# EAGLE design OCTO_CONTROLER_V1 (EAGLE 6.5.0)
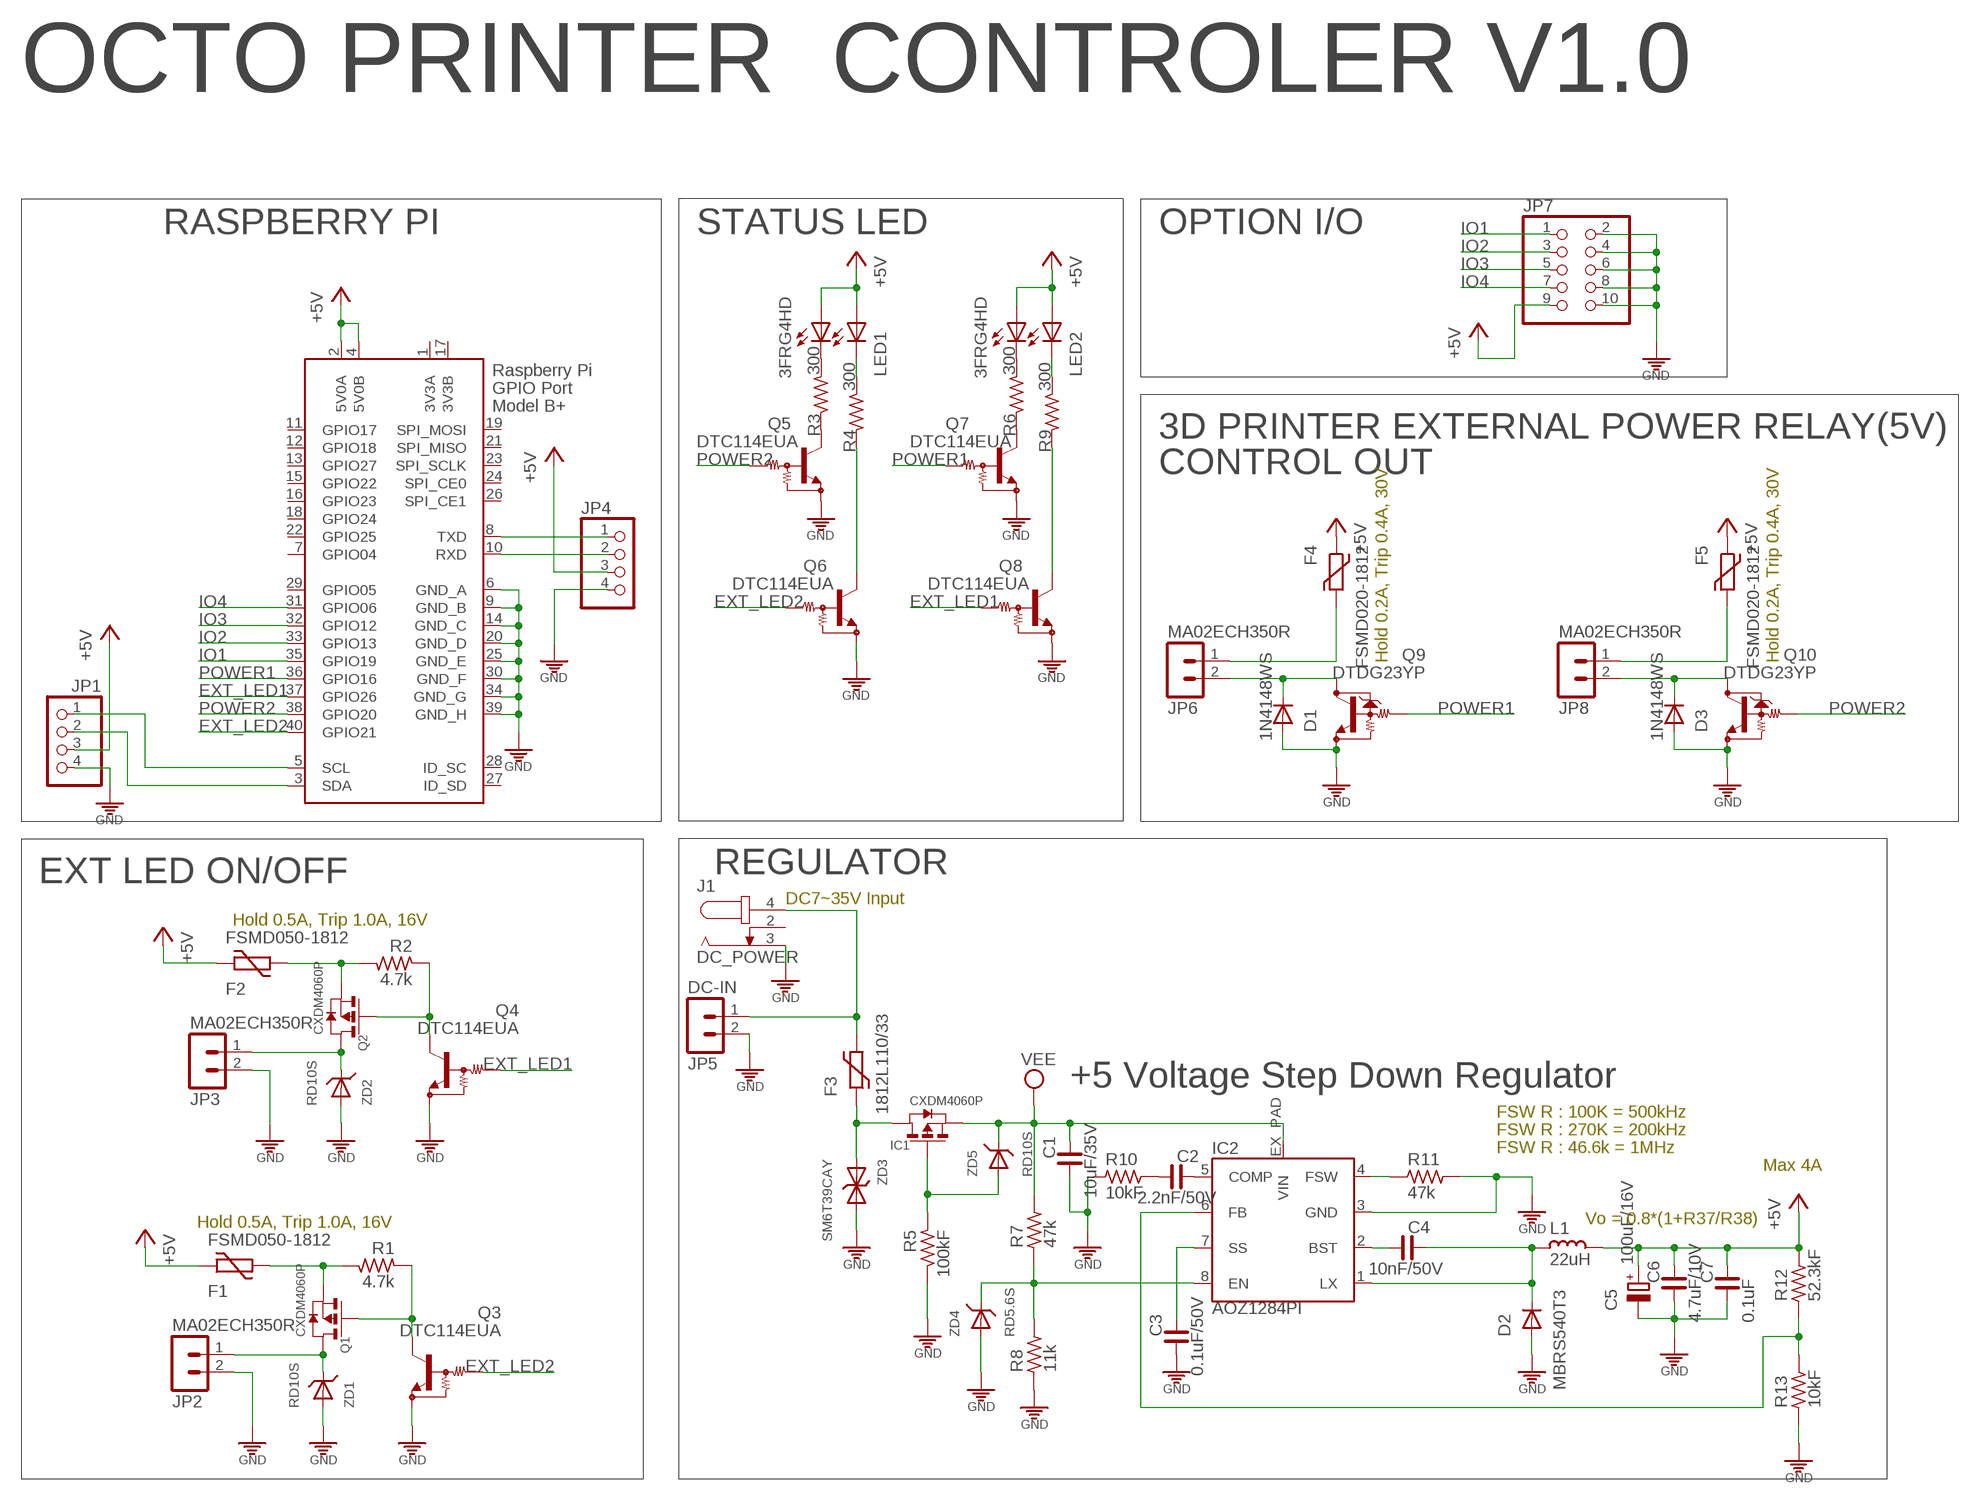
[diagram p0: schematic, sheet 1]

## Parts
C1  10uF/35V  C_3225  [C3225]
C2  2.2nF/50V  C_0603  [C0603]
C3  0.1uF/50V  C_0603  [C0603]
C4  10nF/50V  C_0603  [C0603]
C5  100uF/16V  CPOL-EUD/7343-31W  [D/7343-31W]
C6  4.7uF/10V  C_2012  [C2012]
C7  0.1uF  C_0603  [C0603]
D1  1N4148WS  B5189WN  [SOD323]
D2  MBRS540T3  DIODE-SMC  [SMC]
D3  1N4148WS  B5189WN  [SOD323]
F1  FSMD050-1812  1812L  [1812L]
F2  FSMD050-1812  1812L  [1812L]
F3  1812L110/33  1812L  [1812L]
F4  FSMD020-1812  1812L  [1812L]
F5  FSMD020-1812  1812L  [1812L]
IC1  CXDM4060P  CXDM4060PCXDM4060P  [SOT89]
IC2  AOZ1284PI  [S08-EP1]
J1  DC_POWER  DC-JACK005A  [DC-005]
JP1  PINHD-1X4  [1X04]
JP2  MA02ECH350R  [ECH350R-02]
JP3  MA02ECH350R  [ECH350R-02]
JP4  PINHD-1X4  [1X04]
JP5  DC-IN  MA02ECH350R  [ECH350R-02]
JP6  MA02ECH350R  [ECH350R-02]
JP7  PINHD-2X5/90  [2X05/90]
JP8  MA02ECH350R  [ECH350R-02]
L1  22uH  L_SHP1260P-F  [SHP1260P-F]
LED1  3FRG4HD  [3FRG4H]
LED2  3FRG4HD  [3FRG4H]
Q1  CXDM4060P  CXDM4060PCXDM4060P  [SOT89]
Q2  CXDM4060P  CXDM4060PCXDM4060P  [SOT89]
Q3  DTC114EUA  [SC59-BEC]
Q4  DTC114EUA  [SC59-BEC]
Q5  DTC114EUA  [SC59-BEC]
Q6  DTC114EUA  [SC59-BEC]
Q7  DTC114EUA  [SC59-BEC]
Q8  DTC114EUA  [SC59-BEC]
Q9  DTDG23YP  [MPT3]
Q10  DTDG23YP  [MPT3]
R1  4.7k  R_0603  [R0603]
R2  4.7k  R_0603  [R0603]
R3  300  R_0603  [R0603]
R4  300  R_0603  [R0603]
R5  100kF  R_0603  [R0603]
R6  300  R_0603  [R0603]
R7  47k  R_0603  [R0603]
R8  11k  R_0603  [R0603]
R9  300  R_0603  [R0603]
R10  10kF  R_0603  [R0603]
R11  47k  R_0603  [R0603]
R12  52.3kF  R_0603  [R0603]
R13  10kF  R_0603  [R0603]
X1  RASPI_BOARD_B+#_F  [RASPI_BOARD_B+_FULL]
ZD1  RD10S  ZENER_DIODERD47S  [DSMM]
ZD2  RD10S  ZENER_DIODERD47S  [DSMM]
ZD3  SM6T39CAY  ZDSM6T33CAY  [SMB]
ZD4  RD5.6S  ZENER_DIODERD47S  [DSMM]
ZD5  RD10S  ZENER_DIODERD47S  [DSMM]

## Nets
+5V: C5.+ C6.1 C7.1 F1.P$1 F2.P$1 F4.P$1 F5.P$1 JP1.3 JP4.3 JP7.9 L1.1 LED1.A1(A2) LED1.A(A1) LED2.A1(A2) LED2.A(A1) R12.2 X1.2(5V0A) X1.4(5V0B)
DC-IN: F3.P$1 IC1.2(D) IC1.2@1(D) ZD3.A
EXT_LED1: Q4.2(IN) Q8.2(IN) X1.37(GPIO26)
EXT_LED2: Q3.2(IN) Q6.2(IN) X1.40(GPIO21)
GND [GND]: C1.2 C3.2 C5.- C6.2 C7.2 D1.A D2.A D3.A IC2.3(GND) J1.3 JP1.4 JP2.2 JP3.2 JP4.4 JP5.2 JP7.2 JP7.4 JP7.6 JP7.8 JP7.10 Q3.1(GND) Q4.1(GND) Q5.1(GND) Q6.1(GND) Q7.1(GND) Q8.1(GND) Q9.EMITTER(GND) Q10.EMITTER(GND) R5.2 R8.1 R10.1 R11.2 R13.1 X1.6(GND_A) X1.9(GND_B) X1.14(GND_C) X1.20(GND_D) X1.25(GND_E) X1.30(GND_F) X1.34(GND_G) X1.39(GND_H) ZD1.A ZD2.A ZD3.C(K) ZD4.A
IO1: JP7.1 X1.35(GPIO19)
IO2: JP7.3 X1.33(GPIO13)
IO3: JP7.5 X1.32(GPIO12)
IO4: JP7.7 X1.31(GPIO06)
N$1: D1.C JP6.2 Q9.COLLECTOR(OUT)
N$2: Q1.3(G) Q3.3(OUT) R1.1
N$3: JP2.1 Q1.2(D) Q1.2@1(D) ZD1.C
N$4: F2.P$2 Q2.1(S) R2.2
N$7: F1.P$2 Q1.1(S) R1.2
N$8: D3.C JP8.2 Q10.COLLECTOR(OUT)
N$9: F5.P$2 JP8.1
N$11: F4.P$2 JP6.1
N$12: IC2.6(FB) R12.1 R13.2
N$13: JP1.1 X1.5(SCL)
N$14: C4.2 IC2.2(BST)
N$15: JP3.1 Q2.2(D) Q2.2@1(D) ZD2.C
N$16: JP1.2 X1.3(SDA)
N$17: JP4.1 X1.8(TXD)
N$18: JP4.2 X1.10(RXD)
N$27: C4.1 D2.C IC2.1(LX) L1.2
N$28: IC2.4(FSW) R11.1
N$29: C3.1 IC2.7(SS)
N$30: IC2.8(EN) R7.1 R8.2 ZD4.C
N$31: C2.1 IC2.5(COMP)
N$32: Q2.3(G) Q4.3(OUT) R2.1
N$34: C2.2 R10.2
N$60: Q5.3(OUT) R3.2
N$61: LED1.K(C1) R3.1
N$62: LED1.K1(C2) R4.1
N$77: Q7.3(OUT) R6.2
N$78: LED2.K(C1) R6.1
N$79: LED2.K1(C2) R9.1
N$80: Q8.3(OUT) R9.2
N$85: Q6.3(OUT) R4.2
N$98: IC1.3(G) R5.1 ZD5.A
N$99: F3.P$2 J1.4 JP5.1
POWER1: Q7.2(IN) Q9.BASE(IN) X1.36(GPIO16)
POWER2: Q5.2(IN) Q10.BASE(IN) X1.38(GPIO20)
VEE: C1.1 IC1.1(S) IC2.EX_PAD(VIN) R7.2 ZD5.C
Unconnected: J1.2 X1.7(GPIO04) X1.11(GPIO17) X1.12(GPIO18) X1.13(GPIO27) X1.15(GPIO22) X1.16(GPIO23) X1.18(GPIO24) X1.19(SPI_MOSI) X1.21(SPI_MISO) X1.22(GPIO25) X1.23(SPI_SCLK) X1.24(SPI_CE0) X1.26(SPI_CE1) X1.27(ID_SD) X1.28(ID_SC) X1.29(GPIO05)

## Notes on the sheet
- OCTO PRINTER  CONTROLER V1.0
- RASPBERRY PI | STATUS LED | OPTION I/O
- 3D PRINTER EXTERNAL POWER RELAY(5V)
- CONTROL OUT
- Hold 0.2A, Trip 0.4A, 30V | Hold 0.2A, Trip 0.4A, 30V
- EXT LED ON/OFF
- REGULATOR
- DC7~35V Input
- Hold 0.5A, Trip 1.0A, 16V
- +5 Voltage Step Down Regulator
- FSW R : 100K = 500kHz
- FSW R : 270K = 200kHz
- FSW R : 46.6k = 1MHz
- Max 4A
- Vo = 0.8*(1+R37/R38)
- Hold 0.5A, Trip 1.0A, 16V

## Power pins joined to a net without a drawn wire
3V3A: X1.1(3V3A)
3V3B: X1.17(3V3B)

## Library data of the parts
C1-C4 C6 C7 = cona_lib:C_: NON-POLARIZED CAP
C5 = cona_lib:CPOL-EU: POLARIZED CAPACITOR, European symbol
D1 D3 = cona_lib:B5189W
D2 = diode:DIODE-: DIODE
F1-F5 = ptc-littlefuse:1812L
IC1 Q1 Q2 = cona_lib:CXDM4060P
IC2 = cona_lib:AOZ1284PI
J1 = cona_lib:DC-JACK
JP1 JP4 = pinhead_254:PINHD-1X4: PIN HEADER
JP2 JP3 JP5 JP6 JP8 = cona_lib:MA02
JP7 = pinhead_254:PINHD-2X5: PIN HEADER
L1 = cona_lib:L_: INDUCTOR
LED1 LED2 = cona_lib:3FRG4HD
Q3-Q8 = cona_lib:DTC114EUA: NPN Bias Resistor Transistor
Q9 Q10 = cona_lib:DTDG23YP
R1-R13 = cona_lib:R_: RESISTOR
X1 = raspberrypi_bastelstube_v13:RASPI_BOARD_B+#: Raspberry Pi GPIO connector with markings for the outer dimensions of the Raspberry Pi board model B+ with different sets of drill holes or mounting pads All pins connected
ZD1 ZD2 ZD4 ZD5 = GRU-EURO6:ZENER_DIODE
ZD3 = GRU-EURO6:ZD

## Net classes
0 default: clearance 0.152 mm
1 power: width 0.152 mm
2 GND: width 0.152 mm, clearance 0.152 mm

## Board
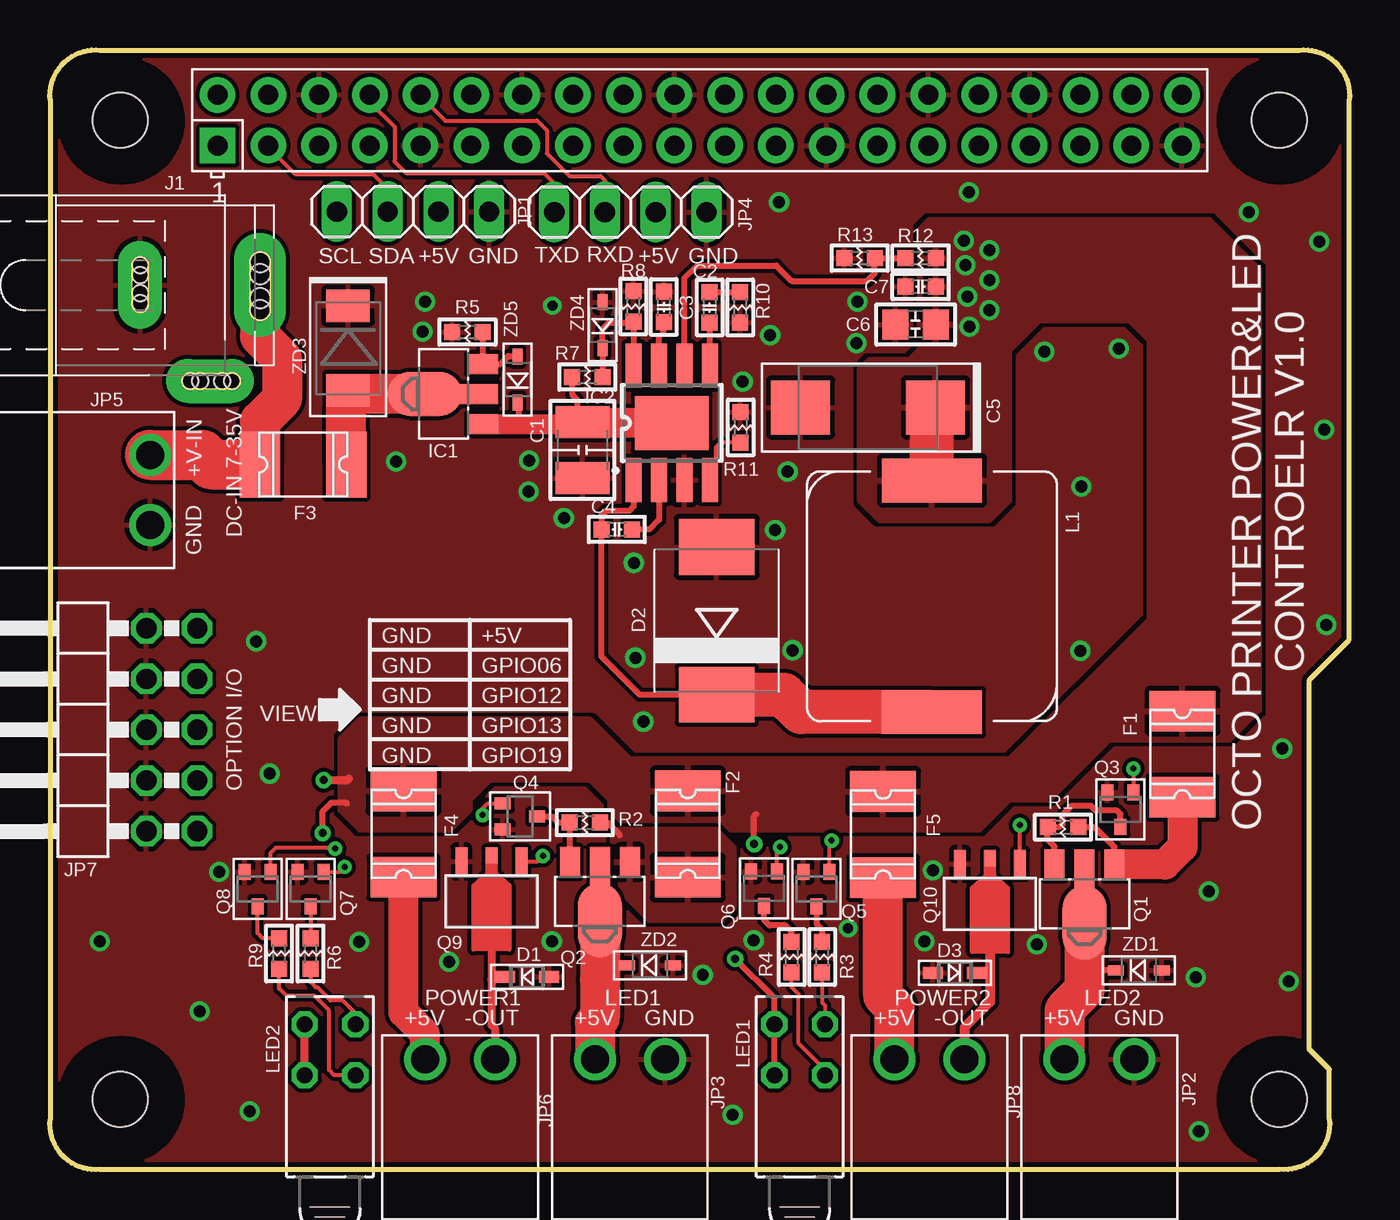
[diagram p1: board, top side]
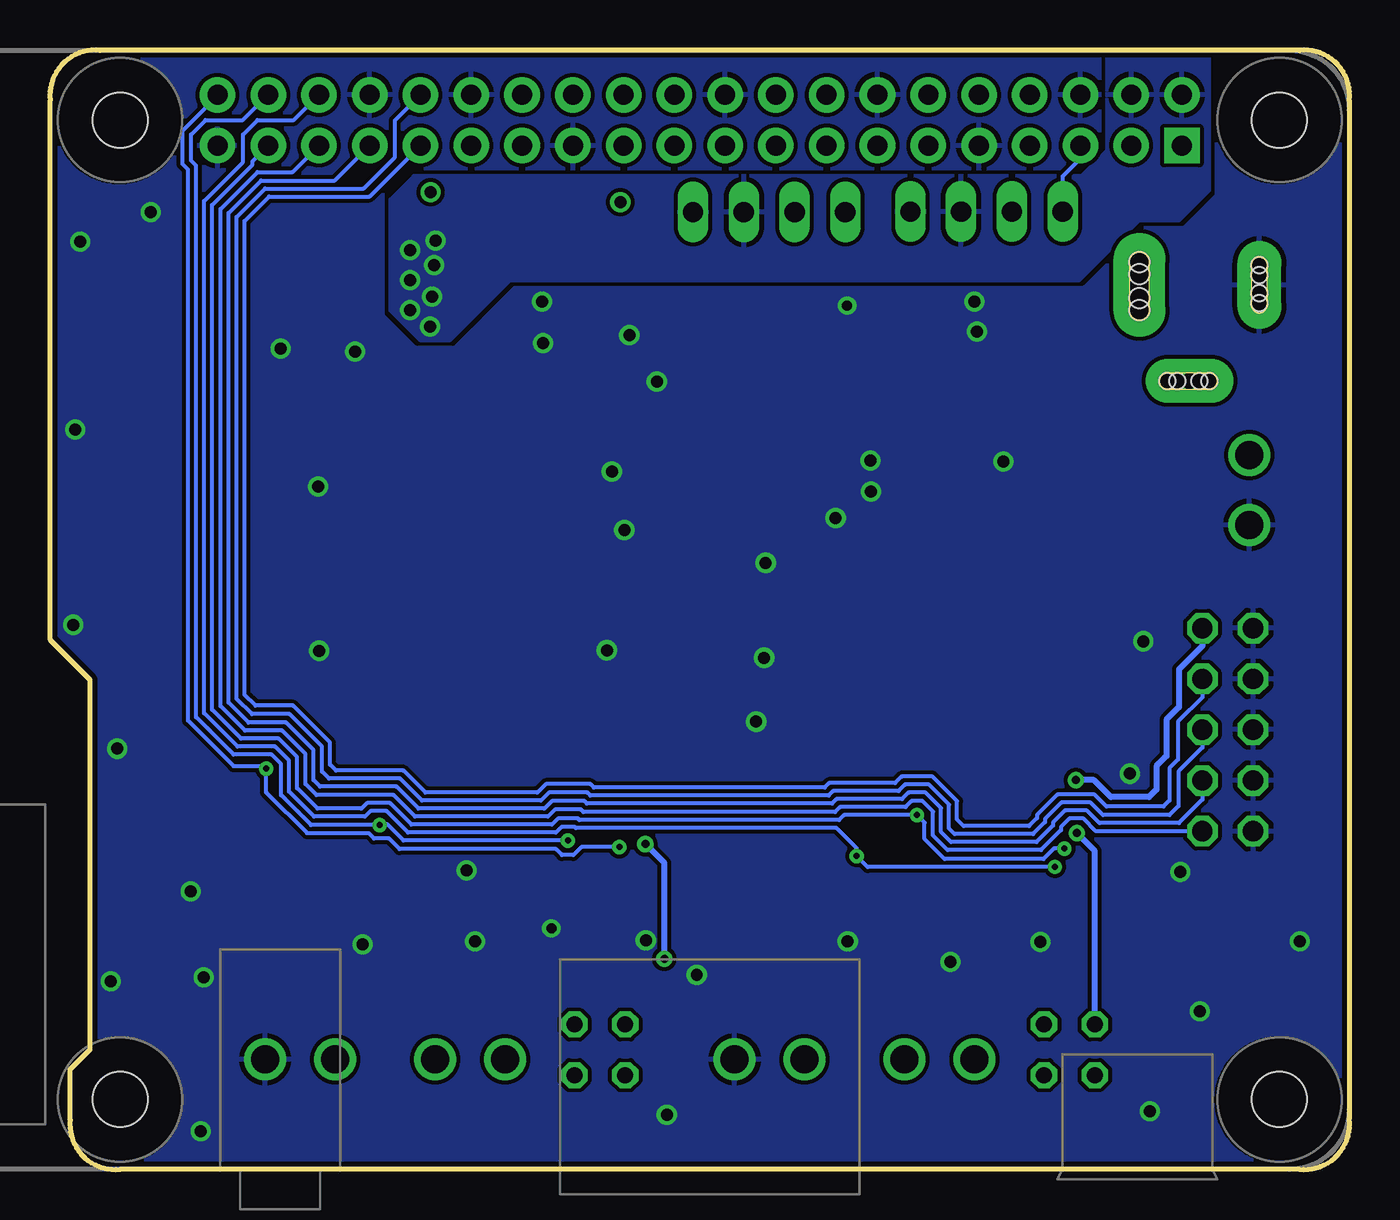
[diagram p2: board, bottom side, seen from below]

Size 65.03 x 56.03 mm. Coordinates in mm from the lower left corner, seen from the top.
Outline: 0.01,53.51 0.01,2.51 arc103 2.51,0.01 61.51,0.01 arc103 64.01,2.51 64.01,5.01 63.01,6.01 63.01,24.51 65.01,26.51 65.01,53.51 arc103 62.51,56.01 2.51,56.01 arc103 0.01,53.51
Copper layers (1*16): Top 0.035mm / dielectric 1.5mm / Bottom 0.035mm
Design rules "KHC_mm": minimum track width 0.2mm, minimum drill 0.3mm, track to track 0.2mm, track to pad 0.2mm, pad to pad 0.2mm, via to via 0.2mm, smd to smd 0.2mm, copper to edge 10mil, drill to drill 0.2mm, minimum pad ring 10mil, minimum via ring 8mil, stop-mask expansion 4mil, vias tented up to drill 0mil, thermal gap 10mil

### Footprints (pad centres in the part's own frame; a part is rotated, then mirrored left to right if it is on the bottom)
C3225 = smd 1.6 x 2.7: 1 -1.397,0; 2 1.397,0
C0603 = smd 0.8 x 0.8: 1 -0.762,0; 2 0.762,0
D/7343-31W = smd 2.95 x 2.7: + 3.375,0; - -3.375,0
C2012 = smd 1.3 x 1.5: 1 -1.016,0; 2 1.016,0
SOD323 = smd 1 x 0.6: A 1.1,0; C -1.1,0
SMC = smd 2.8 x 3.8: A 3.7,0; C -3.7,0
1812L = smd 2.03 x 3.3: P$1 -2.16,0; P$2 2.16,0
SOT89 = smd 1 x 1.5: 1 -1.499,-1.981; 3 1.499,-1.981 | smd 1 x 2: 2 0,-1.727 | smd 2.2 x 3.7: 2@1 0,0.94
S08-EP1 = smd 0.8 x 2.2: 1 -1.905,-2.87; 2 -0.635,-2.87; 3 0.635,-2.87; 4 1.905,-2.87; 5 1.905,2.87; 6 0.635,2.87; 7 -0.635,2.87; 8 -1.905,2.87 | smd 3.7 x 2.71: EX_PAD 0,0
DC-005 = drill 0.8 pad 2.2 long: 2 11,-4.8; 3 7.5,0 | drill 1 pad 2.6 long: 4 13.5,0 | hole 0.8: 7.5,1; 7.5,0.5; 7.5,-0.9; 7.5,-0.4; 10,-4.8; 10.5,-4.8; 12.1,-4.8; 11.6,-4.8 | hole 1: 13.5,1.15; 13.5,0.55; 13.5,-1.25; 13.5,-0.65
1X04 = drill 1.016 long: 1 -3.81,0; 2 -1.27,0; 3 1.27,0; 4 3.81,0
ECH350R-02 = drill 1.4: 1 -1.75,0; 2 1.75,0
2X05/90 = drill 1.016 octagon: 1 -5.08,-6.35; 2 -5.08,-3.81; 3 -2.54,-6.35; 4 -2.54,-3.81; 5 0,-6.35; 6 0,-3.81; 7 2.54,-6.35; 8 2.54,-3.81; 9 5.08,-6.35; 10 5.08,-3.81
SHP1260P-F = smd 2.2 x 5: 1 -5.8,0; 2 5.8,0
3FRG4H = drill 0.8 octagon: A 0,1.27; A1 -2.54,1.27; K 0,-1.27; K1 -2.54,-1.27
SC59-BEC = smd 0.6 x 0.8: 1 0.65,-0.863; 2 -0.65,-0.863; 3 0,0.863
MPT3 = smd 0.6 x 1.4: BASE -1.5,-2; EMITTER 1.5,-2 | smd 0.6 x 0.8: COLLECTOR 0,-2.3
R0603 = smd 0.8 x 0.8: 1 -0.762,0; 2 0.762,0
RASPI_BOARD_B+_FULL = drill 1 pad 1.778 square: 1 8.37,51.23 | drill 1 pad 1.778: 2 8.37,53.77; 3 10.91,51.23; 4 10.91,53.77; 5 13.45,51.23; 6 13.45,53.77; 7 15.99,51.23; 8 15.99,53.77; 9 18.53,51.23; 10 18.53,53.77; 11 21.07,51.23; 12 21.07,53.77; 13 23.61,51.23; 14 23.61,53.77; 15 26.15,51.23; 16 26.15,53.77; 17 28.69,51.23; 18 28.69,53.77; 19 31.23,51.23; 20 31.23,53.77; 21 33.77,51.23; 22 33.77,53.77; 23 36.31,51.23; 24 36.31,53.77; 25 38.85,51.23; 26 38.85,53.77; 27 41.39,51.23; 28 41.39,53.77; 29 43.93,51.23; 30 43.93,53.77; 31 46.47,51.23; 32 46.47,53.77; 33 49.01,51.23; 34 49.01,53.77; 35 51.55,51.23; 36 51.55,53.77; 37 54.09,51.23; 38 54.09,53.77; 39 56.63,51.23; 40 56.63,53.77 | hole 2.75: 3.5,3.5; 3.5,52.5; 61.5,3.5; 61.5,52.5
DSMM = smd 0.8 x 0.5: A 1.15,0; C -1.15,0
SMB = smd 1.62 x 2.18: A 2.11,0; C -2.11,0

### Placement (x,y rotation side)
C1  26.64,36.01 270 top
C2  33.01,43.14 90 top
C3  30.71,43.16 90 top
C4  28.36,32.04 0 top
C5  40.94,38.14 0 top
C6  43.31,42.29 180 top
C7  43.56,44.19 180 top
D1  23.86,9.64 0 top
D2  33.36,27.46 90 top
D3  45.29,9.84 180 top
F1  56.66,20.79 270 top
F2  31.91,16.79 270 top
F3  12.66,35.29 180 top
F4  17.69,16.79 270 top
F5  41.69,16.76 270 top
IC1  19.69,38.81 90 top
IC2  31.11,37.36 0 top
J1  -2.99,44.26 0 top
JP1  18.16,47.94 0 top
JP2  52.51,5.51 0 top
JP3  29.01,5.51 0 top
JP4  29.04,47.91 0 top
JP5  5.01,34.01 270 top
JP6  20.51,5.51 0 top
JP7  1.01,22.01 90 top
JP8  44.01,5.51 0 top
L1  44.14,28.69 270 top
LED1  37.51,7.26 90 top
LED2  14.01,7.26 90 top
Q1  51.76,13.29 180 top
Q2  27.51,13.41 180 top
Q3  53.56,18.01 180 top
Q4  23.51,17.66 270 top
Q5  38.36,14.04 180 top
Q6  35.74,14.06 180 top
Q7  13.04,14.04 180 top
Q8  10.39,14.04 180 top
Q9  22.09,13.41 180 top
Q10  47.04,13.29 180 top
R1  50.69,17.14 0 top
R2  26.76,17.36 0 top
R3  38.64,10.64 90 top
R4  37.11,10.64 90 top
R5  20.89,41.91 180 top
R6  13.04,10.81 90 top
R7  26.89,39.66 180 top
R8  29.19,43.19 270 top
R9  11.46,10.81 90 top
R10  34.54,43.14 90 top
R11  34.56,37.14 90 top
R12  43.56,45.61 0 top
R13  40.51,45.61 0 top
X1  0.01,0.01 0 top
ZD1  54.49,9.96 0 top
ZD2  30.01,10.21 0 top
ZD3  14.91,41.11 270 top
ZD4  27.64,42.26 90 top
ZD5  23.39,39.54 90 top

### Tracks (layer width: path | path; a pad name or v marks a point on that pad's centre or on a via)
+5V  (via drill 0.4, 0.6)
  Top 0.3: LED1.A1 LED1.A 36.24,8.58 v34.29,10.54 | v35.24,16.29 35.24,17.69 35.34,17.79 | v13.64,16.84 13.64,17.91 14.09,18.36 14.81,18.36 14.86,18.31
  Top 0.4: LED2.A1 LED2.A | v13.69,19.49 14.89,19.49 14.96,19.56
  Top 2.2: L1.1 44.14,37.96 C5.+
  Bottom 0.3: v34.29,10.54 34.29,15.34 v35.24,16.29 | LED2.A 12.74,15.94 v13.64,16.84 | JP7.9 7.36,26.21 8.54,25.04 8.54,23.14 9.16,22.51 9.16,20.69 9.66,20.19 9.66,19.01 10.04,18.64 11.94,18.64 12.79,19.49 v13.69,19.49
  other vias: 47.01,46.01 47.01,44.51 47.01,43.01 45.81,45.26 45.91,43.69 46.01,42.19 45.74,46.49
  pour Top: 41.51,32.51 47.01,32.51 48.01,33.51 48.01,46.01 47.01,47.01 44.01,47.01 43.51,46.51 43.51,41.01 43.01,40.51 41.01,40.51 40.51,40.01 40.51,33.51
  pour Bottom: 7.01,56.01 12.14,56.01 12.14,50.99 13.41,49.71 46.81,49.71 48.01,48.51 48.01,43.01 46.51,41.51 45.01,41.51 42.01,44.51 13.51,44.51 10.51,47.51 8.51,47.51 7.01,49.01
  pour Top (rank 2): 15.51,17.01 20.01,17.01 21.01,18.01 21.01,18.51 22.01,19.51 27.01,19.51 28.01,18.51 28.01,18.01 29.01,17.01 46.51,17.01 48.01,18.51 50.01,18.51 53.01,21.51 59.01,21.51 60.51,23.01 60.51,45.01 58.01,47.51 44.01,47.51 43.51,47.01 43.51,45.01 46.01,42.51 47.51,40.51 49.51,42.51 54.01,42.51 55.01,41.51 55.01,27.51 48.01,20.51 29.01,20.51 27.01,22.51 15.51,22.51 14.51,21.51 14.51,18.01
DC-IN
  Top 0.3: IC1.2@1 IC1.2
  Top 1: 15.66,38.79 15.13,38.79 ZD3.A 14.96,38.95 14.96,38.29
  Top 2: F3.P$1 14.82,38.15 14.96,38.29 | IC1.2@1 15.69,38.81 15.66,38.79
EXT_LED1  (via drill 0.3)
  Top 0.2: v21.64,17.74 21.64,18.06 21.89,18.31 Q4.2 | Q8.2 11.04,15.84 11.31,16.11 14.21,16.11 v14.26,16.06
  Bottom 0.2: v14.26,16.06 14.79,16.06 15.31,15.54 20.26,15.54 21.26,16.54 21.26,17.36 v21.64,17.74 25.29,17.74 25.54,17.49 38.54,17.49 38.61,17.56 39.61,17.56 39.91,17.26 46.94,17.26 48.01,18.34 49.16,18.34 49.44,18.06 51.64,18.06 52.66,19.09 52.66,20.64 53.59,21.56 55.46,21.56 56.91,23.01 56.91,48.26 54.89,50.29 54.89,50.46 X1.37
EXT_LED2  (via drill 0.3)
  Top 0.2: v54.21,20.06 Q3.2 | Q6.2 36.39,15.99 v36.54,16.14
  Bottom 0.2: X1.40 56.64,53.73 58.39,51.99 58.39,50.31 58.11,50.04 58.11,22.46 55.84,20.19 54.34,20.19 v54.21,20.06 Q3.2 54.2,18.88 52.16,16.84 49.09,16.84 48.81,16.56 48.06,16.56 47.54,16.04 39.71,16.04 39.41,15.74 38.84,15.74 38.44,16.14 v36.54,16.14
GND  (via drill 0.5, 0.6)
  other vias: 40.41,43.44 40.36,41.36 36.04,41.76 34.66,39.44 36.91,34.94 29.21,30.36 36.29,32.01 18.64,41.94 18.76,43.44 25.14,43.24 35.21,11.46 44.19,14.96 49.39,11.26 57.34,9.61 43.76,11.41 32.66,9.74 25.11,11.41 19.96,10.39 8.46,14.89 53.49,41.09 49.76,40.94 51.61,34.19 51.56,25.96 29.69,22.41 10.99,19.81 17.31,35.44 25.71,32.61 59.99,47.91 45.99,48.91 36.49,48.41 63.51,46.44 63.76,37.04 63.86,27.26 61.66,21.06 61.99,9.41 57.99,13.91 7.49,7.91 2.49,11.41 39.94,12.06 34.16,2.74 57.49,1.91 9.99,2.91 10.31,26.44 15.46,11.39 29.29,25.61 37.16,25.99 23.96,35.49 23.94,33.94
  pour Top (rank 4): 0.01,0.01 0.01,56.01 76.01,56.01 76.01,0.01
  pour Bottom (rank 4): 0.01,0.01 0.01,56.01 76.01,56.01 76.01,0.01
IO1
  Bottom 0.2: JP7.1 12.68,16.93 13.31,17.56 14.01,17.56 14.44,17.14 14.44,16.99 15.44,15.99 20.11,15.99 20.84,16.71 20.84,17.91 21.36,18.44 21.91,18.44 22.21,18.14 25.49,18.14 25.74,17.89 38.34,17.89 38.46,18.01 39.76,18.01 40.11,17.66 46.76,17.66 47.84,18.74 51.69,18.74 52.24,19.29 52.24,20.79 53.41,21.96 55.26,21.96 56.49,23.19 56.49,48.06 54.64,49.91 52.89,49.91 X1.35
IO2
  Bottom 0.2: JP7.3 7.36,18.51 8.54,17.34 12.51,17.34 13.14,17.96 14.24,17.96 14.84,17.36 14.84,17.21 15.66,16.39 19.94,16.39 20.44,16.89 20.44,18.09 21.21,18.86 22.06,18.86 22.39,18.54 25.66,18.54 25.89,18.31 38.16,18.31 38.29,18.44 39.91,18.44 40.29,18.06 46.59,18.06 47.69,19.16 51.51,19.16 51.84,19.49 51.84,20.99 53.21,22.36 55.09,22.36 56.09,23.36 56.09,47.86 54.46,49.49 50.78,49.49 X1.33
IO3
  Bottom 0.2: JP7.5 7.36,21.11 8.56,19.91 8.56,18.19 9.01,17.74 12.34,17.74 12.96,18.36 14.41,18.36 15.24,17.54 15.24,17.39 15.84,16.79 19.76,16.79 20.04,17.06 20.04,18.26 21.04,19.26 22.24,19.26 22.56,18.94 25.84,18.94 26.06,18.71 37.99,18.71 38.14,18.86 40.06,18.86 40.46,18.46 46.41,18.46 47.51,19.56 51.06,19.56 51.41,19.91 51.41,21.16 53.04,22.79 54.91,22.79 55.69,23.56 55.69,47.66 54.26,49.09 49.34,49.09 47.76,50.66 47.76,52.5 X1.32
IO4
  Bottom 0.2: JP7.7 7.36,23.64 8.59,22.41 8.59,20.51 9.01,20.09 9.01,18.46 9.31,18.16 12.16,18.16 12.76,18.76 14.61,18.76 15.64,17.74 15.64,17.59 16.04,17.19 19.31,17.19 19.64,17.51 19.64,18.44 20.86,19.66 22.41,19.66 22.74,19.34 26.04,19.34 26.26,19.11 37.81,19.11 37.99,19.29 40.21,19.29 40.64,18.86 46.24,18.86 47.34,19.96 50.71,19.96 51.01,20.26 51.01,21.36 52.86,23.21 54.74,23.21 55.29,23.76 55.29,47.46 54.06,48.69 49.04,48.69 X1.31
N$1
  Top 0.4: Q9.COLLECTOR 22.09,9.51 | 22.09,9.51 22.09,7.24 22.26,7.06 JP6.2 | D1.C 22.24,9.66 22.09,9.51
N$2
  Top 0.3: Q1.3 50.26,16.16 49.91,16.51 R1.1 49.94,17.15 50.53,17.15 50.66,17.29 50.66,17.74 51.14,18.21 52.06,18.21 52.31,17.96 53.39,17.96 53.56,17.79 Q3.3
N$3
  Top 0.3: ZD1.C 51.81,9.96 51.76,9.51 | Q1.2@1 Q1.2
  Top 2: Q1.2@1 51.76,9.51 51.76,8.99 50.76,7.99 JP2.1
N$4
  Top 0.3: R2.2 27.89,17.36 28.51,16.74
  pour Top: 29.51,17.01 33.31,17.01 34.21,16.11 34.21,13.09 33.59,12.46 30.01,12.46 28.16,14.31 28.16,16.66 28.51,17.01
N$5
  cutout Top: 3.56,6.49 arc90 0.56,3.49 arc90 3.56,0.49 arc90 6.56,3.49 arc90
  cutout Bottom: 3.56,6.49 arc90 0.56,3.49 arc90 3.56,0.49 arc90 6.56,3.49 arc90
N$6
  cutout Top: 3.56,55.49 arc90 0.56,52.49 arc90 3.56,49.49 arc90 6.56,52.49 arc90
  cutout Bottom: 3.56,55.49 arc90 0.56,52.49 arc90 3.56,49.49 arc90 6.56,52.49 arc90
N$7
  Top 0.2: Q1.1 53.88,15.27 53.89,15.26
  Top 0.3: R1.2 52.26,17.14 53.26,16.14 Q1.1
  Top 1.5: F1.P$2 56.66,16.14 55.79,15.26 53.89,15.26
N$8
  Top 0.3: D3.C 46.86,9.84 47.04,10.01
  Top 0.5: Q10.COLLECTOR 47.04,10.01 47.04,8.39 45.76,7.11 JP8.2
N$9
  Top 2: JP8.1 42.26,8.11 41.69,8.69 F5.P$2
N$10
  cutout Top: 61.56,55.49 arc90 58.56,52.49 arc90 61.56,49.49 arc90 64.56,52.49 arc90
  cutout Bottom: 61.56,55.49 arc90 58.56,52.49 arc90 61.56,49.49 arc90 64.56,52.49 arc90
  cutout Bottom: 61.56,6.49 arc90 58.56,3.49 arc90 61.56,0.49 arc90 64.56,3.49 arc90
  cutout Top: 61.56,6.49 arc90 58.56,3.49 arc90 61.56,0.49 arc90 64.56,3.49 arc90
N$11
  Top 1.5: JP6.1 18.76,6.79 17.69,7.86 F4.P$2
N$12
  Top 0.3: IC2.6 31.75,44.6 32.39,45.24 36.34,45.24 37.11,44.46 40.89,44.46 41.26,44.84 41.26,45.6 R13.2 R12.1
N$13
  Bottom 0.2: X1.5 13.46,50.59 14.36,49.69 14.36,47.95 JP1.1
N$14
  Top 0.3: IC2.2 30.48,32.53 29.99,32.04 C4.2
N$15
  Top 0.3: ZD2.C 27.71,10.21 27.51,9.51 | Q2.2@1 Q2.2
  Top 2: Q2.2@1 27.51,9.51 27.51,7.59 27.26,7.34 JP3.1
N$16
  Top 0.2: X1.3 10.92,51.15 12.26,49.81 16.16,49.81 16.89,49.09 JP1.2
N$17
  Top 0.2: X1.8 16,53.42 17.24,52.19 17.24,50.44 17.81,49.86 24.71,49.86 25.21,49.36 25.21,47.93 JP4.1
N$18
  Top 0.2: X1.10 18.54,53.71 19.76,52.49 24.36,52.49 24.86,51.99 24.86,50.84 25.99,49.71 27.54,49.71 27.76,49.49 JP4.2
N$27
  Top 0.3: IC2.1 29.21,33.18 28.99,32.96 27.81,32.96 27.59,32.74 27.59,32.05 C4.1 27.59,32.03 27.59,25.69 29.51,23.76 D2.C
  Top 2.2: L1.2 37.59,22.89 36.71,23.76 D2.C
N$28
  Top 0.2: R11.1 33.55,36.38 33.31,36.14 33.31,34.79 IC2.4
N$29
  Top 0.3: IC2.7 30.48,41.65 30.69,41.86 30.69,42.38 C3.1
N$30
  Top 0.3: 29.18,42.44 R8.2 | R8.2 29.19,40.25 IC2.8 | R7.1 27.64,39.68 ZD4.C 27.64,42.06 27.96,42.39 29.15,42.39 R8.2
N$31
  Top 0.3: IC2.5 C2.1
N$32
  Top 0.3: Q2.3 26.01,17.35 R2.1 25.41,17.36 25.11,17.66 Q4.3
N$34
  Top 0.3: C2.2 R10.2
N$60
  Top 0.3: Q5.3 38.36,12.29 38.64,12.01 R3.2
N$61
  Top 0.2: R3.1 38.64,8.36 38.79,8.21 LED1.K
N$62
  Top 0.2: LED1.K1 38.78,4.99 37.46,6.31 37.46,8.79 37.11,9.14 R4.1
N$77
  Top 0.2: Q7.3 R6.2
N$78
  Top 0.2: R6.1 13.04,9.39 13.29,9.14 13.36,9.14 14.04,8.46 14.64,8.46 15.28,7.82 LED2.K
N$79
  Top 0.2: LED2.K1 14.23,4.72 13.96,4.99 13.96,7.96 13.24,8.69 11.84,8.69 11.46,9.06 R9.1
N$80
  Top 0.2: R9.2 10.65,11.58 10.39,11.84 Q8.3
N$85
  Top 0.3: R4.2 37.11,11.91 36.81,12.21 36.01,12.21 35.74,12.49 Q6.3
N$98
  Top 0.3: R5.1 21.67,41.89 IC1.3 22.54,40.31 22.94,40.71 23.46,40.71 ZD5.A
N$99
  Top 1: F3.P$2 9.74,35.29
  Top 2: J1.4 10.51,41.69 11.61,40.59 11.61,38.56 10.51,37.46 10.51,35.3 F3.P$2
  Top 2.5: JP5.1 7.61,35.76 8.09,35.29 9.74,35.29
POWER1  (via drill 0.3)
  Top 0.2: Q9.BASE 24.39,15.41 v24.66,15.69 | Q7.2 14.5,14.9 v14.74,15.14
  Bottom 0.2: X1.36 52.83,52.51 54.64,52.51 55.36,51.79 55.36,50.41 57.31,48.46 57.31,22.84 55.64,21.16 53.76,21.16 53.06,20.46 53.06,18.91 51.81,17.66 49.26,17.66 48.99,17.94 48.19,17.94 47.11,16.86 39.71,16.86 39.44,17.14 38.76,17.14 38.71,17.09 25.66,17.09 24.66,16.09 v24.66,15.69 24.11,15.14 v14.74,15.14
POWER2  (via drill 0.3)
  Top 0.2: Q10.BASE v48.54,17.24 | Q5.2 39.01,16.36 v39.11,16.46
  Bottom 0.2: X1.38 55.37,52.51 57.24,52.51 57.96,51.79 57.96,50.49 57.71,50.24 57.71,22.64 55.84,20.76 53.94,20.76 53.46,20.29 53.46,18.74 51.96,17.24 v48.54,17.24 48.51,17.26 48.14,17.26 47.34,16.46 v39.11,16.46
VEE
  Top 0.3: ZD5.C 23.49,37.34 23.51,37.31 | R7.2 26.13,38.78 26.36,38.54 26.36,37.69 C1.1
  Top 1: IC1.1 23.51,37.31 26.46,37.31 C1.1
  Top 1.5: IC2.EX_PAD 26.52,37.36 C1.1

### Text on the board
_tplace: SCL | SDA | +5V | GND | TXD | RXD | +5V | GND | +V-IN | DC-IN 7-35V | GND | GND | +5V | OPTION I/O | GND | GPIO06 | CONTROELR V1.0 | GND | GPIO12 | VIEW | GND | GPIO13 | GND | GPIO19 | OCTO PRINTER POWER&LED | POWER1 | LED1 | POWER2 | LED2 | +5V | -OUT | +5V | GND | +5V | -OUT | +5V | GND
207bmp: D:/TK/·ΰí/Open-source-hardware-logo.bmp